# EAGLE design Cap-Sense-PCB (EAGLE 8.6.0)
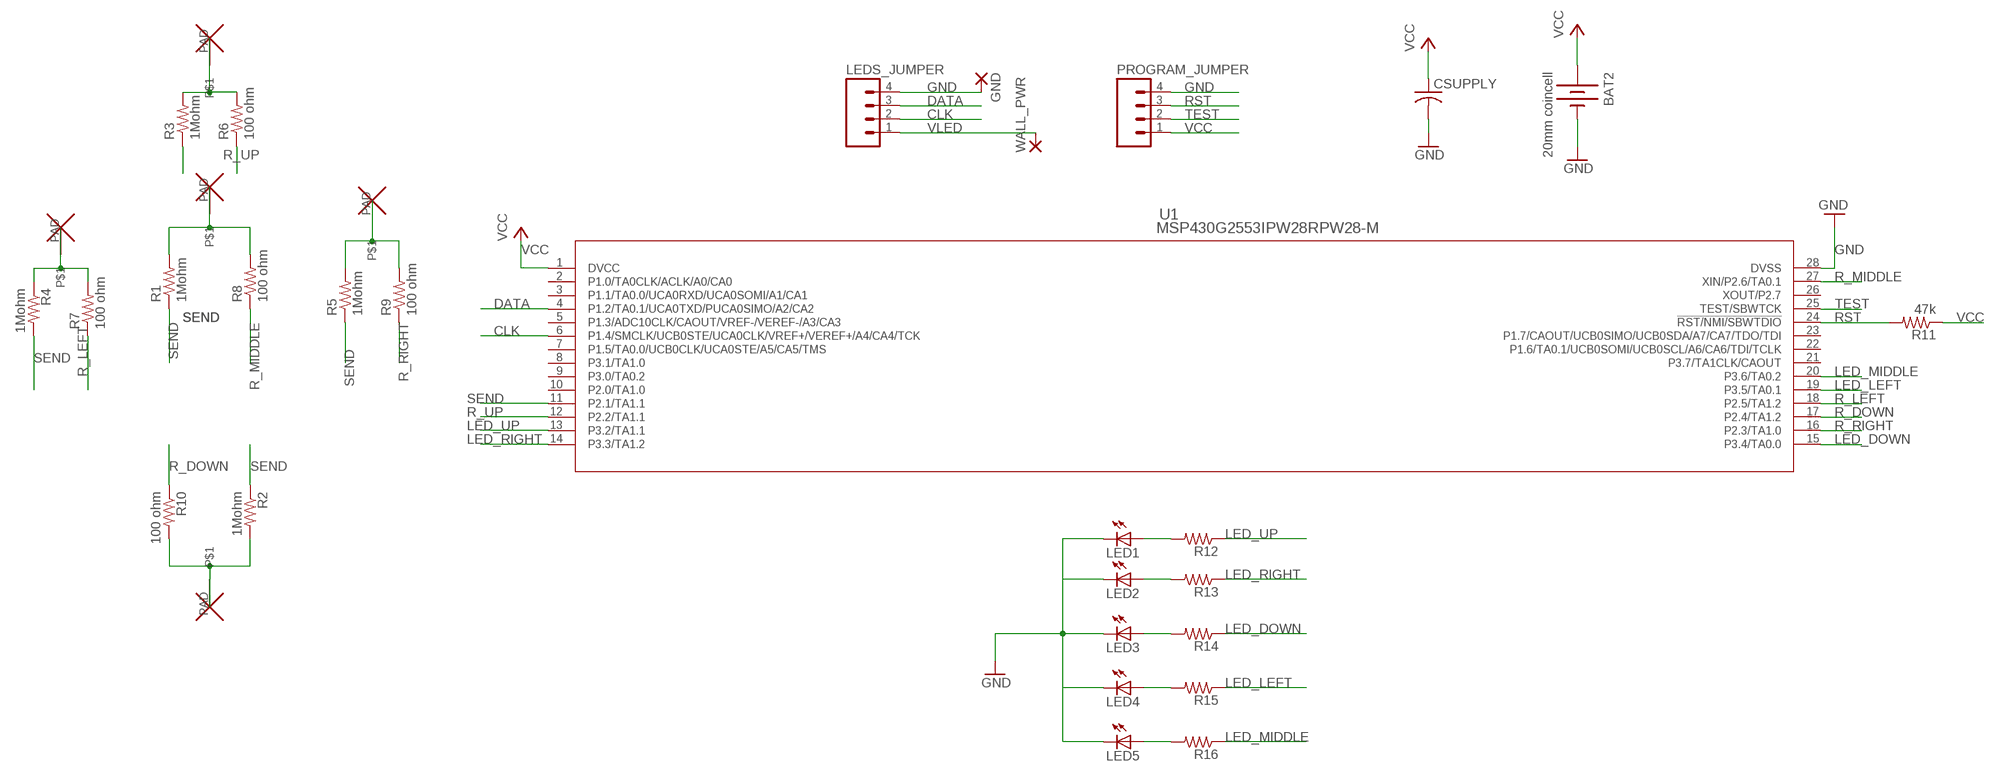
[diagram p0: schematic, sheet 1]

## Parts
BAT2  20mm coincell  BATTERYFOB  [BATTCON_20MM_PTH_COMPACT]
CSUPPLY  C-USC1206  [C1206]
DOWN  KAP_PAD  [KAP_PAD]
GND  SMD5  [SMD2,54-5,08]
LED1  LEDCHIPLED_1206  [CHIPLED_1206]
LED2  LEDCHIPLED_1206  [CHIPLED_1206]
LED3  LEDCHIPLED_1206  [CHIPLED_1206]
LED4  LEDCHIPLED_1206  [CHIPLED_1206]
LED5  LEDCHIPLED_1206  [CHIPLED_1206]
LEDS_JUMPER  M04LOCK  [1X04_LOCK]
LEFT  KAP_PAD  [KAP_PAD]
MIDDLE  KAP_PAD  [KAP_PAD]
PROGRAM_JUMPER  M04LOCK  [1X04_LOCK]
R1  1Mohm  R-US_R1206  [R1206]
R2  1Mohm  R-US_R1206  [R1206]
R3  1Mohm  R-US_R1206  [R1206]
R4  1Mohm  R-US_R1206  [R1206]
R5  1Mohm  R-US_R1206  [R1206]
R6  100 ohm  R-US_R1206  [R1206]
R7  100 ohm  R-US_R1206  [R1206]
R8  100 ohm  R-US_R1206  [R1206]
R9  100 ohm  R-US_R1206  [R1206]
R10  100 ohm  R-US_R1206  [R1206]
R11  47k  R-US_R1206  [R1206]
R12  R-US_R1206  [R1206]
R13  R-US_R1206  [R1206]
R14  R-US_R1206  [R1206]
R15  R-US_R1206  [R1206]
R16  R-US_R1206  [R1206]
RIGHT  KAP_PAD  [KAP_PAD]
U1  MSP430G2553IPW28RPW28-M  [PW28-M]
UP  KAP_PAD  [KAP_PAD]
WALL_PWR  SMD5  [SMD2,54-5,08]

## Nets
CLK: LEDS_JUMPER.2 U1.6(P1.4/SMCLK/UCB0STE/UCA0CLK/VREF+/VEREF+/A4/CA4/TCK)
DATA: LEDS_JUMPER.3 U1.4(P1.2/TA0.1/UCA0TXD/PUCA0SIMO/A2/CA2)
DOWN: DOWN.PAD R2.2 R10.2
GND: BAT2.2(-) CSUPPLY.2 GND.1(P) LED1.C LED2.C LED3.C LED4.C LED5.C LEDS_JUMPER.4 PROGRAM_JUMPER.4 U1.28(DVSS)
LED_DOWN: R14.1 U1.15(P3.4/TA0.0)
LED_LEFT: R15.1 U1.19(P3.5/TA0.1)
LED_MIDDLE: R16.1 U1.20(P3.6/TA0.2)
LED_RIGHT: R13.1 U1.14(P3.3/TA1.2)
LED_UP: R12.1 U1.13(P3.2/TA1.1)
LEFT: LEFT.PAD R4.1 R7.2
MIDDLE: MIDDLE.PAD R1.2 R8.2
N$4: LED1.A R12.2
N$5: LED2.A R13.2
N$6: LED3.A R14.2
N$9: LED4.A R15.2
N$10: LED5.A R16.2
R_DOWN: R10.1 U1.17(P2.4/TA1.2)
R_LEFT: R7.1 U1.18(P2.5/TA1.2)
R_MIDDLE: R8.1 U1.27(XIN/P2.6/TA0.1)
R_RIGHT: R9.1 U1.16(P2.3/TA1.0)
R_UP: R6.1 U1.12(P2.2/TA1.1)
RIGHT: R5.2 R9.2 RIGHT.PAD
RST: PROGRAM_JUMPER.3 R11.2 U1.24(!RST/NMI/SBWTDIO)
SEND: R1.1 R2.1 R3.1 R4.2 R5.1 U1.11(P2.1/TA1.1)
TEST: PROGRAM_JUMPER.2 U1.25(TEST/SBWTCK)
UP: R3.2 R6.2 UP.PAD
VCC: BAT2.1(+) BAT2.3(+) BAT2.4(+) BAT2.5(+) CSUPPLY.1 PROGRAM_JUMPER.1 R11.1 U1.1(DVCC)
VLED: LEDS_JUMPER.1 WALL_PWR.1(P)
Unconnected: U1.2(P1.0/TA0CLK/ACLK/A0/CA0) U1.3(P1.1/TA0.0/UCA0RXD/UCA0SOMI/A1/CA1) U1.5(P1.3/ADC10CLK/CAOUT/VREF-/VEREF-/A3/CA3) U1.7(P1.5/TA0.0/UCB0CLK/UCA0STE/A5/CA5/TMS) U1.8(P3.1/TA1.0) U1.9(P3.0/TA0.2) U1.10(P2.0/TA1.0) U1.21(P3.7/TA1CLK/CAOUT) U1.22(P1.6/TA0.1/UCB0SOMI/UCB0SCL/A6/CA6/TDI/TCLK) U1.23(P1.7/CAOUT/UCB0SIMO/UCB0SDA/A7/CA7/TDO/TDI) U1.26(XOUT/P2.7)

## Library data of the parts
BAT2 = battery:BATTERY: Compact CR2032 Battery Holder SMT ground pad 20MM_4LEGS, Digikey: BAT-HLD-001-THM-OTL
CSUPPLY = rcl:C-US: CAPACITOR, American symbol; SPICEPREFIX: C
DOWN LEFT MIDDLE RIGHT UP = ELEC327_final:KAP_PAD
GND WALL_PWR = wirepad:SMD5: SMD PAD
LED1-LED5 = led:LED: LED OSRAM: - CHIPLED LG R971, LG N971, LY N971, LG Q971, LY Q971, LO R971, LY R971 LH N974, LH R974 LS Q976, LO Q976, LY Q976 LO Q996 - Hyper CHIPLED LW Q18S LB Q993, LB Q99A, LB R99A - SideLED LS A670, LO A670, LY A670, LG A670, LP A670 LB A673, LV A673, LT A673, LW A673 LH A674 LY A675 LS A676, LA A676, LO A676, LY A676, LW A676 LS A679, LY A679, LG A679 - Hyper Micro SIDELED® LS Y876, LA Y876, LO Y876, LY Y876 LT Y87S - SmartLED LW L88C, LW L88S LB L89C, LB L89S, LG L890 LS L89K, LO L89K, LY L89K LS L896, LA L896, LO L896, LY L896 - TOPLED LS T670, LO T670, LY T670, LG T670, LP T670 LSG T670, LSP T670, LSY T670, LOP T670, LYG T670 LG T671, LOG T671, LSG T671 LB T673, LV T673, LT T673, LW T673 LH T674 LS T676, LA T676, LO T676, LY T676, LB T676, LH T676, LSB T676, LW T676 LB T67C, LV T67C, LT T67C, LS T67K, LO T67K, LY T67K, LW E67C LS E67B, LA E67B, LO E67B, LY E67B, LB E67C, LV E67C, LT E67C LW T67C LS T679, LY T679, LG T679 LS T770, LO T770, LY T770, LG T770, LP T770 LB T773, LV T773, LT T773, LW T773 LH T774 LS E675, LA E675, LY E675, LS T675 LS T776, LA T776, LO T776, LY T776, LB T776 LHGB T686 LT T68C, LB T68C - Hyper Mini TOPLED® LB M676 - Mini TOPLED Santana® LG M470 LS M47K, LO M47K, LY M47K Source: http://www.osram.convergy.de LUXEON: - LUMILED® LXK2-PW12-R00, LXK2-PW12-S00, LXK2-PW14-U00, LXK2-PW14-V00 LXK2-PM12-R00, LXK2-PM12-S00, LXK2-PM14-U00 LXK2-PE12-Q00, LXK2-PE12-R00, LXK2-PE12-S00, LXK2-PE14-T00, LXK2-PE14-U00 LXK2-PB12-K00, LXK2-PB12-L00, LXK2-PB12-M00, LXK2-PB14-N00, LXK2-PB14-P00, LXK2-PB14-Q00 LXK2-PR12-L00, LXK2-PR12-M00, LXK2-PR14-Q00, LXK2-PR14-R00 LXK2-PD12-Q00, LXK2-PD12-R00, LXK2-PD12-S00 LXK2-PH12-R00, LXK2-PH12-S00 LXK2-PL12-P00, LXK2-PL12-Q00, LXK2-PL12-R00 Source: www.luxeon.com KINGBRIGHT: KA-3528ASYC Source: www.kingbright.com
LEDS_JUMPER PROGRAM_JUMPER = SparkFun:M04: Header 4 Standard 4-pin 0.1" header. Use with straight break away headers (SKU : PRT-00116), right angle break away headers (PRT-00553), swiss pins (PRT-00743), machine pins (PRT-00117), and female headers (PRT-00115). Molex polarized connector foot print use with SKU : PRT-08231 with associated crimp pins and housings. 1MM SMD Version SKU: PRT-10208
R1-R11 = adafruit:R-US_: RESISTOR, American symbol
R12-R16 = rcl:R-US_: RESISTOR, American symbol; SPICEPREFIX: R
U1 = ELEC327_msp430_28pin:MSP430G2553IPW28R; MANUFACTURER_PART_NUMBER: MSP430G2553IPW28R; VENDOR: Texas Instruments

## Board
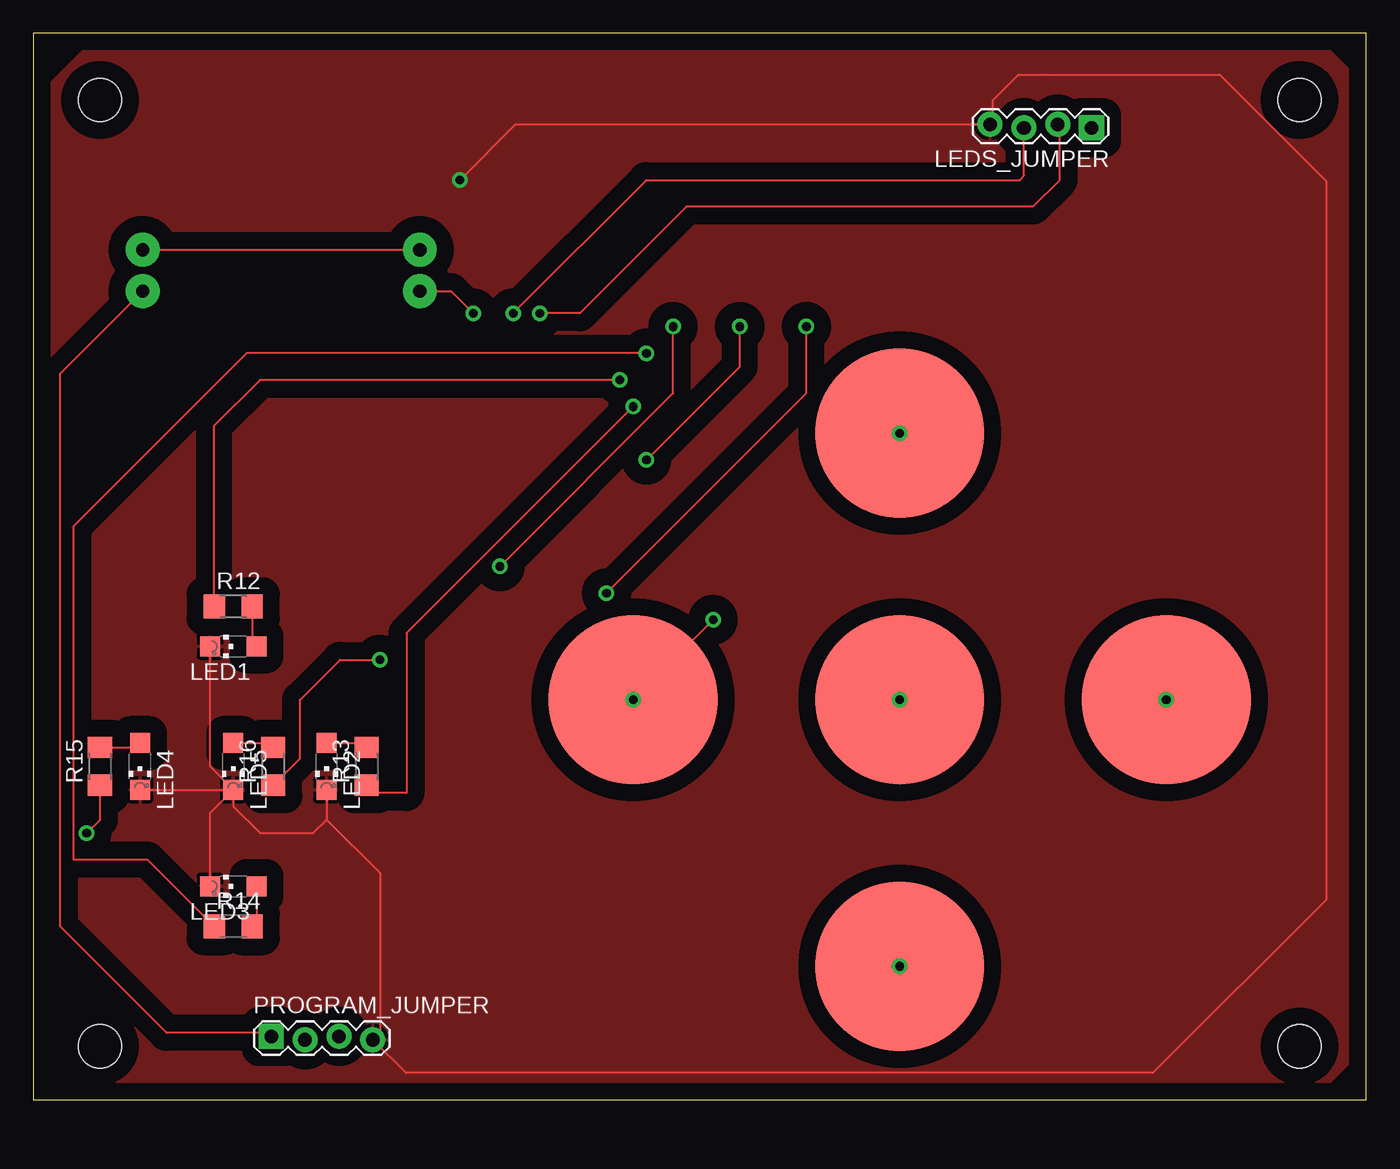
[diagram p1: board, top side]
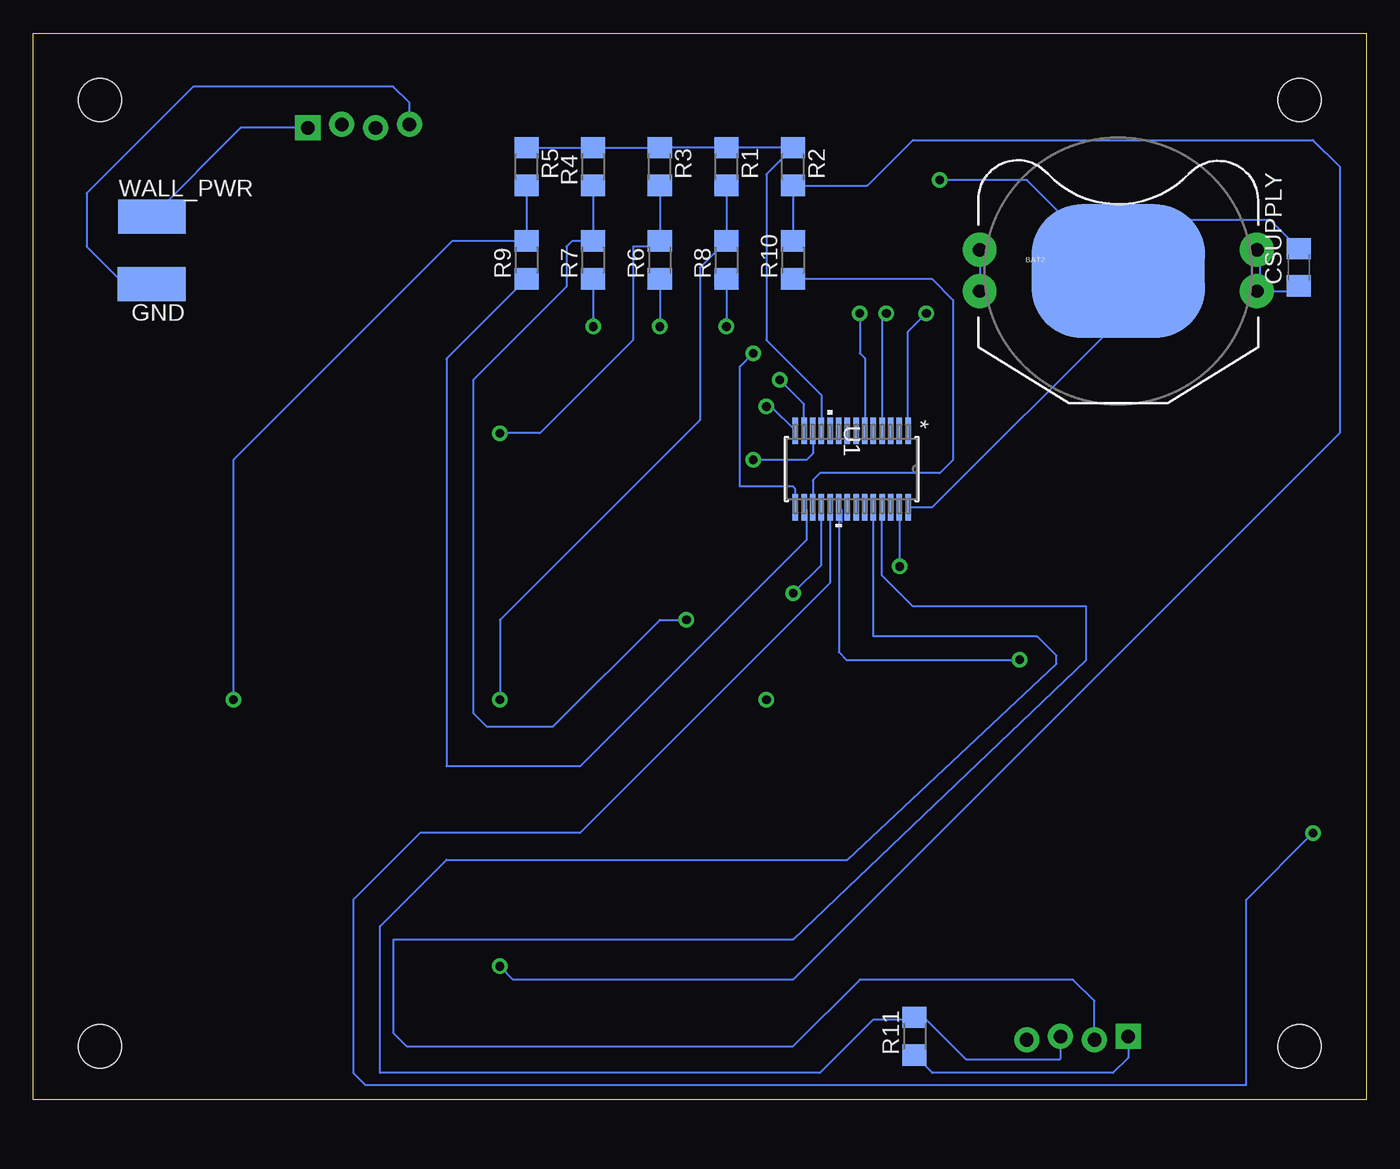
[diagram p2: board, bottom side, seen from below]

Size 100 x 80 mm. Coordinates in mm from the lower left corner, seen from the top.
Outline: 0,0 100,0 100,80 0,80 0,0
Copper layers (1*16): Top 0.035mm / dielectric 1.5mm / Bottom 0.035mm
Design rules "AdvancedCircuitsBarebones": minimum track width 6mil, minimum drill 20mil, track to track 6mil, track to pad 6mil, pad to pad 6mil, via to via 6mil, smd to smd 6mil, copper to edge 10mil, drill to drill 6mil, minimum pad ring 12mil, minimum via ring 10mil, stop-mask expansion 4mil, vias tented up to drill 25mil, thermal gap 10mil
Holes 3.25 mm at 5,75 95,75 95,4 5,4

### Footprints (pad centres in the part's own frame; a part is rotated, then mirrored left to right if it is on the bottom)
BATTCON_20MM_PTH_COMPACT = drill 1 pad 2.54: 1 -10.4,1.6; 3 10.4,1.6; 4 10.4,-1.5; 5 -10.4,-1.5 | smd 13 x 10: 2 0,0
C1206 = smd 1.6 x 1.8: 1 -1.4,0; 2 1.4,0
KAP_PAD = smd 12.7 x 12.7: PAD 0,0
SMD2,54-5,08 = smd 2.54 x 5.08: 1 0,0
CHIPLED_1206 = smd 1.5 x 1.5: A 0,-1.75; C 0,1.75
1X04_LOCK = drill 1.016 pad 1.88 square: 1 0,0.127 | drill 1.016 pad 1.88: 2 2.54,-0.127; 3 5.08,0.127; 4 7.62,-0.127
R1206 = smd 1.6 x 1.803: 1 -1.422,0; 2 1.422,0
PW28-M = smd 1.981 x 0.406: 1 -2.87,4.225; 2 -2.87,3.575; 3 -2.87,2.925; 4 -2.87,2.275; 5 -2.87,1.625; 6 -2.87,0.975; 7 -2.87,0.325; 8 -2.87,-0.325; 9 -2.87,-0.975; 10 -2.87,-1.625; 11 -2.87,-2.275; 12 -2.87,-2.925; 13 -2.87,-3.575; 14 -2.87,-4.225; 15 2.87,-4.225; 16 2.87,-3.575; 17 2.87,-2.925; 18 2.87,-2.275; 19 2.87,-1.625; 20 2.87,-0.975; 21 2.87,-0.325; 22 2.87,0.325; 23 2.87,0.975; 24 2.87,1.625; 25 2.87,2.275; 26 2.87,2.925; 27 2.87,3.575; 28 2.87,4.225

### Placement (x,y rotation side)
BAT2  18.6,62.16 0 bottom
CSUPPLY  5.04,62.44 90 bottom
DOWN  65,10 0 top
GND  91.12,61.17 90 bottom
LED1  15,34 90 top
LED2  22,25 180 top
LED3  15,16 90 top
LED4  8,25 180 top
LED5  15,25 180 top
LEDS_JUMPER  79.4,73.04 180 top
LEFT  45,30 0 top
MIDDLE  65,30 180 top
PROGRAM_JUMPER  17.85,4.61 0 top
R1  48,70 270 bottom
R2  43,70 270 bottom
R3  53,70 270 bottom
R4  58,70 90 bottom
R5  63,70 270 bottom
R6  53,63 90 bottom
R7  58,63 90 bottom
R8  48,63 90 bottom
R9  63,63 90 bottom
R10  43,63 90 bottom
R11  33.88,4.75 90 bottom
R12  15,37 0 top
R13  25,25 90 top
R14  15,13 0 top
R15  5,25 90 top
R16  18,25 90 top
RIGHT  85,30 0 top
U1  38.6,47.31 270 bottom
UP  65,50 0 top
WALL_PWR  91.1,66.24 270 bottom

### Tracks (layer width: path | path; a pad name or v marks a point on that pad's centre or on a via)
CLK  (via drill 0.65)
  Top 0.152: LEDS_JUMPER.2 77,73.03 77,69 75,67 49,67 41,59 v38,59
  Bottom 0.152: U1.6 37.62,55.62 38,56 v38,59
DATA  (via drill 0.65)
  Top 0.152: LEDS_JUMPER.3 74.32,69.32 74,69 46,69 v36,59
  Bottom 0.152: v36,59 36.33,58.67 U1.4
DOWN  (via drill 0.65)
  Bottom 0.152: R10.2 R2.2 37.42,68.58 34,72 4,72 2,70 2,50 43,9 64,9 DOWN.PAD
  other vias: 65,10
GND  (via drill 0.65)
  Top 0.152: v32,69 36.17,73.17 LEDS_JUMPER.4 72,73.39 72,75 73.91,76.91 75.52,76.91 76,76.91 89,76.91 97,68.91 97,15 84,2 27.95,2 PROGRAM_JUMPER.4 26,5.01 26,17 22,21 | LED4.C LED5.C | LED3.C 13.25,21.5 LED5.C | 22,21 21,20 17,20 15,22 LED5.C | LED2.C 22,21 | LED5.C 13.25,25 LED1.C
  Bottom 0.152: BAT2.2 18.72,62.28 | 18.72,62.28 25.44,69 v32,69 | CSUPPLY.2 7.2,66 15,66 18.5,62.5 | 18.5,62.5 18.72,62.28 | LEDS_JUMPER.4 71.78,74.78 73,76 88,76 96,68 96,64 93,61 92.83,61.17 GND.1 | U1.28 32.56,44.44 18.5,58.5 18.5,62.5
  pour Top (isolate 1.27): 5,80 96,80 100,76 100,4 96,0 4,0 0,4 0,75
LED_DOWN  (via drill 0.65)
  Top 0.152: R14.1 8.58,18 3,18 3,43 16,56 v46,56
  Bottom 0.152: U1.15 42.83,45.83 43,46 47,46 47,55 v46,56
LED_LEFT  (via drill 0.65)
  Top 0.152: v4,20 5,21 R15.1
  Bottom 0.152: U1.19 40.23,38.77 59,20 71,20 76,15 76,2 75.09,1.09 9,1.09 9,15 v4,20
LED_MIDDLE  (via drill 0.65)
  Top 0.152: R16.1 20,25.58 20,30 23,33 v26,33
  Bottom 0.152: 39.36,43.35 39.36,44.22 U1.20 39.58,33.58 39,33 v26,33
LED_RIGHT  (via drill 0.65)
  Top 0.152: v45,52 37,44 28,35 28,23 25.58,23 R13.1
  Bottom 0.152: U1.14 44.65,52 v45,52
LED_UP  (via drill 0.65)
  Top 0.152: v44,54 17,54 13.58,50.58 R12.1
  Bottom 0.152: U1.13 42.17,52.17 v44,54
LEFT  (via drill 0.65)
  Top 0.152: LEFT.PAD v51,36
  Bottom 0.152: R4.1 R7.2 59.58,64.42 60,64 60,61 67,54 67,29 66,28 61,28 53,36 v51,36
  other vias: 45,30
MIDDLE  (via drill 0.65)
  Bottom 0.152: R1.2 R8.2 50,62.42 50,51 65,36 MIDDLE.PAD
  other vias: 65,30
N$4
  Top 0.152: R12.2 16.42,34.33 LED1.A
N$5
  Top 0.152: LED2.A 24.67,26.75 R13.2
N$6
  Top 0.152: LED3.A 16.75,13.33 R14.2
N$9
  Top 0.152: R15.2 7.67,26.42 LED4.A
N$10
  Top 0.152: LED5.A 17.67,26.75 R16.2
R_DOWN
  Bottom 0.152: R10.1 32.58,61.58 31,60 31,48 32,47 41,47 41.52,46.48 U1.17
R_LEFT  (via drill 0.65)
  Top 0.152: v43,38 58,53 v58,58
  Bottom 0.152: U1.18 40.88,40.12 v43,38 | R7.1 v58,58
R_MIDDLE  (via drill 0.65)
  Top 0.152: v35,40 48,53 v48,58
  Bottom 0.152: U1.27 35.02,40.02 v35,40 | R8.1 v48,58
R_RIGHT
  Bottom 0.152: R9.1 69,55.58 69,25 59,25 42,42 42,44.27 U1.16
R_UP  (via drill 0.65)
  Top 0.152: v46,48 53,55 v53,58
  Bottom 0.152: U1.12 41.52,48.48 42,48 v46,48 | R6.1 v53,58
RIGHT  (via drill 0.65)
  Bottom 0.152: R5.2 R9.2 68.58,64.42 85,48 RIGHT.PAD
  other vias: 85,30
RST
  Bottom 0.152: PROGRAM_JUMPER.3 22.93,3.07 23,3 30,3 33.17,6.17 R11.2 34.05,6 37,6 41,2 74,2 74,13 69,18 38.93,18 23.24,32.69 23.24,33.31 24.69,34.76 37,34.76 37,44 36.98,44.02 U1.24
SEND
  Bottom 0.152: R5.1 R4.2 R3.1 R1.1 R2.1 45,69.42 45,57 40.88,52.88 U1.11
TEST
  Bottom 0.152: U1.25 36.33,39.33 34,37 21,37 21,33 43,12 73,12 73,5 72,4 43,4 38,9 22,9 20.39,7.39 PROGRAM_JUMPER.2
UP  (via drill 0.65)
  Bottom 0.152: R3.2 R6.2 53.42,64 55,64 55,57 62,50 UP.PAD
  other vias: 65,50
VCC  (via drill 0.65)
  Top 0.152: BAT2.3 BAT2.1 | BAT2.4 2,54.46 2,13 10,5 17.59,5 PROGRAM_JUMPER.1 | BAT2.5 31.34,60.66 v33,59
  Bottom 0.152: BAT2.4 8,60.66 | 8,60.66 5.42,60.66 CSUPPLY.1 | BAT2.3 8,63.56 8,60.66 | BAT2.1 BAT2.5 | PROGRAM_JUMPER.1 17.85,3.15 19,2 32.55,2 R11.1 | U1.1 34.38,57.62 v33,59
VLED
  Bottom 0.152: LEDS_JUMPER.1 84.43,72.91 WALL_PWR.1